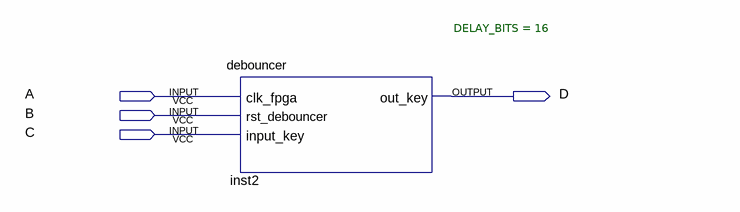
[diagram p0: schematic sheet]
// Quartus schematic Prince2.bdf as structural Verilog: 1 symbols, 4 pins
module Prince2 (
  input  A,
  input  B,
  input  C,
  output D
);

  debouncer #(.DELAY_BITS(16)) inst2 (.clk_fpga(A), .rst_debouncer(B), .input_key(C), .out_key(D));
endmodule
